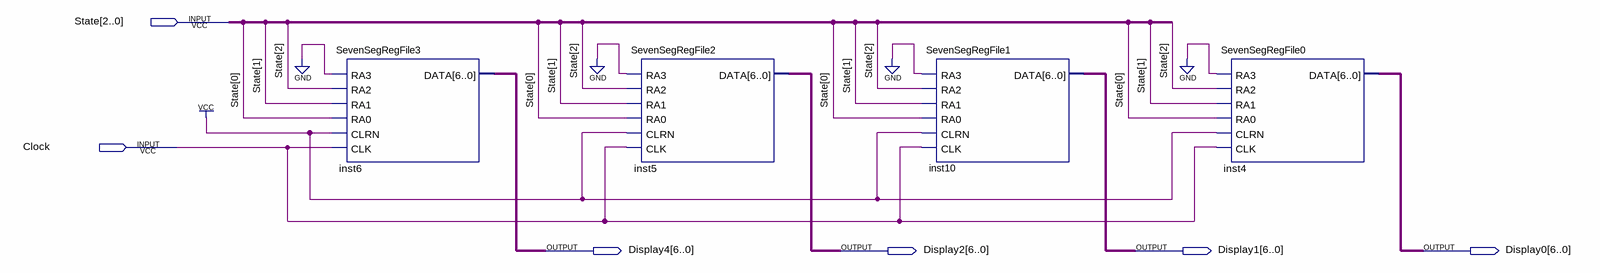
[diagram p0: schematic sheet]
// Quartus schematic Display.bdf as structural Verilog: 4 symbols, 6 pins
module Display (
  input  [2:0] State,
  input  Clock,
  output [6:0] Display4,
  output [6:0] Display2,
  output [6:0] Display1,
  output [6:0] Display0
);

  SevenSegRegFile3 inst6 (
    .RA3(1'b0), .RA2(State[2]), .RA1(State[1]), .RA0(State[0]), .CLRN(1'b1), .CLK(Clock), .DATA(Display4));
  SevenSegRegFile2 inst5 (
    .RA3(1'b0), .RA2(State[2]), .RA1(State[1]), .RA0(State[0]), .CLRN(1'b1), .CLK(Clock), .DATA(Display2));
  SevenSegRegFile1 inst10 (
    .RA3(1'b0), .RA2(State[2]), .RA1(State[1]), .RA0(State[0]), .CLRN(1'b1), .CLK(Clock), .DATA(Display1));
  SevenSegRegFile0 inst4 (
    .RA3(1'b0), .RA2(State[2]), .RA1(State[1]), .RA0(State[0]), .CLRN(1'b1), .CLK(Clock), .DATA(Display0));
endmodule
